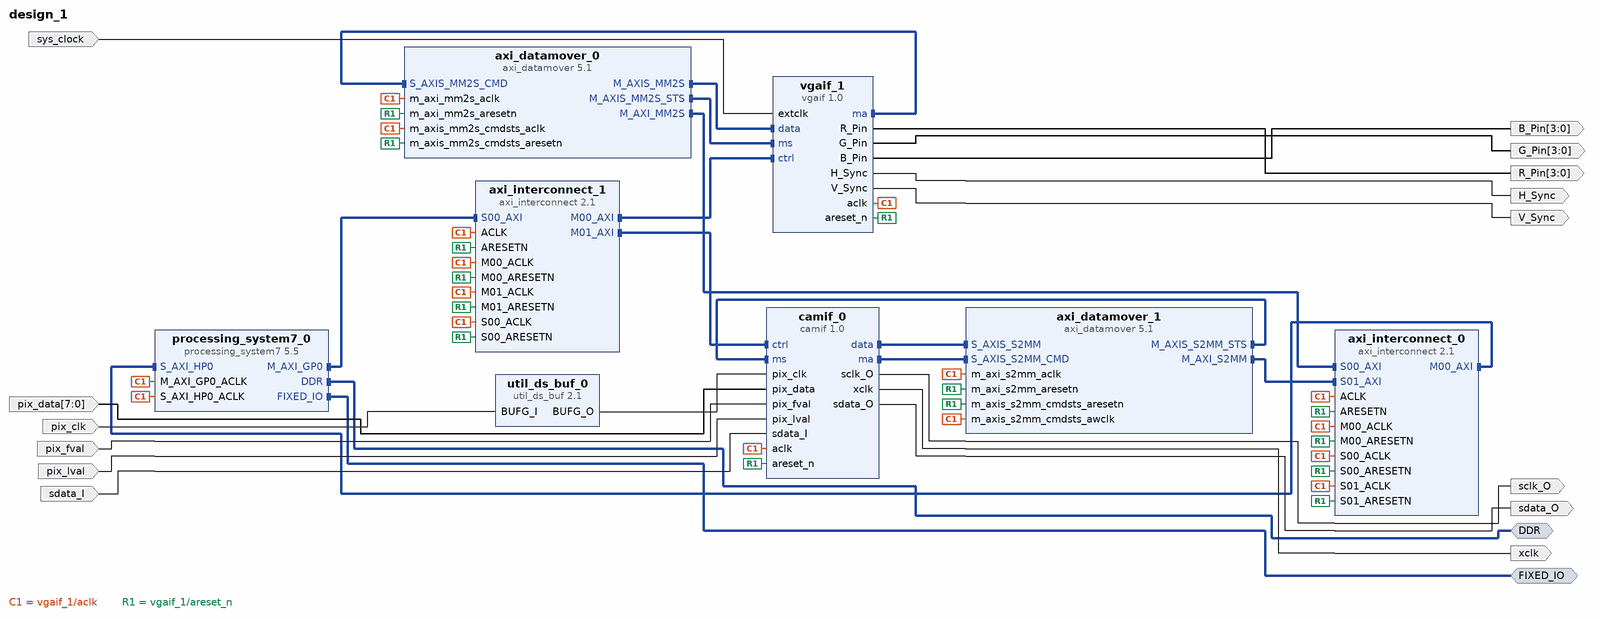
[diagram p0: block diagram of the top level]
# Vivado block design design_1, xc7z020clg484-1, Vivado 2017.2
create_bd_design design_1

create_bd_intf_port -mode Master -vlnv xilinx.com:interface:ddrx_rtl:1.0 DDR
create_bd_intf_port -mode Master -vlnv xilinx.com:display_processing_system7:fixedio_rtl:1.0 FIXED_IO
create_bd_port -dir I -type clk sys_clock
set_property -dict {CONFIG.FREQ_HZ 100000000 CONFIG.PHASE 0.000} [get_bd_ports sys_clock]
create_bd_port -dir O -from 3 -to 0 R_Pin
create_bd_port -dir O -from 3 -to 0 G_Pin
create_bd_port -dir O -from 3 -to 0 B_Pin
create_bd_port -dir O H_Sync
create_bd_port -dir O V_Sync
create_bd_port -dir O xclk
create_bd_port -dir I -from 7 -to 0 pix_data
create_bd_port -dir I pix_fval
create_bd_port -dir I pix_lval
create_bd_port -dir I -type clk pix_clk
create_bd_port -dir O sclk_O
create_bd_port -dir O sdata_O
create_bd_port -dir I sdata_I

create_bd_cell -type ip -vlnv xilinx.com:ip:axi_datamover:5.1 axi_datamover_0
set_property -dict [list \
  CONFIG.c_m_axi_mm2s_data_width 64 \
  CONFIG.c_m_axis_mm2s_tdata_width 32 \
  CONFIG.c_mm2s_burst_size 8 \
  CONFIG.c_enable_s2mm 0 \
] [get_bd_cells axi_datamover_0]
create_bd_cell -type ip -vlnv xilinx.com:ip:processing_system7:5.5 processing_system7_0
set_property -dict [list \
  CONFIG.PCW_USE_S_AXI_HP0 1 \
  CONFIG.PCW_EN_CLK0_PORT 0 \
  CONFIG.PCW_QSPI_GRP_SINGLE_SS_ENABLE 1 \
  CONFIG.PCW_USB0_PERIPHERAL_ENABLE 0 \
  CONFIG.preset ZedBoard \
] [get_bd_cells processing_system7_0]
# 1 more settings of processing_system7_0 are not shown: defaults, MIO pin electricals, DDR timing, and values the tool derives
create_bd_cell -type ip -vlnv xilinx.com:ip:axi_interconnect:2.1 axi_interconnect_0
set_property -dict {CONFIG.NUM_SI 2 CONFIG.NUM_MI 1} [get_bd_cells axi_interconnect_0]
create_bd_cell -type ip -vlnv xilinx.com:ip:axi_interconnect:2.1 axi_interconnect_1
set_property -dict {CONFIG.NUM_MI 2} [get_bd_cells axi_interconnect_1]
create_bd_cell -type ip -vlnv xilinx.com:ip:axi_datamover:5.1 axi_datamover_1
set_property -dict [list \
  CONFIG.c_include_s2mm Full \
  CONFIG.c_include_s2mm_stsfifo true \
  CONFIG.c_s2mm_addr_pipe_depth 3 \
  CONFIG.c_s2mm_include_sf true \
  CONFIG.c_m_axi_s2mm_awid 1 \
  CONFIG.c_enable_mm2s 0 \
  CONFIG.c_enable_s2mm 1 \
  CONFIG.c_enable_s2mm_adv_sig 0 \
] [get_bd_cells axi_datamover_1]
create_bd_cell -type ip -vlnv xilinx.com:ip:util_ds_buf:2.1 util_ds_buf_0
set_property -dict {CONFIG.C_BUF_TYPE BUFG} [get_bd_cells util_ds_buf_0]
create_bd_cell -type ip -vlnv user.org:user:vgaif:1.0 vgaif_1
set_property -dict {CONFIG.G_VIDEOX 2048 CONFIG.G_VIDEOY 2048 CONFIG.G_SCREENX 800 CONFIG.G_SCREENY 600} [get_bd_cells vgaif_1]
create_bd_cell -type ip -vlnv user.org:user:camif:1.0 camif_0
set_property -dict {CONFIG.G_CAMERAX 800 CONFIG.G_CAMERAY 600 CONFIG.G_ID 0xACDE1234} [get_bd_cells camif_0]

# ---- connections ----

connect_bd_intf_net [get_bd_intf_pins axi_interconnect_0/M00_AXI] [get_bd_intf_pins processing_system7_0/S_AXI_HP0]
connect_bd_intf_net [get_bd_intf_pins axi_datamover_0/M_AXI_MM2S] [get_bd_intf_pins axi_interconnect_0/S00_AXI]
connect_bd_intf_net [get_bd_intf_pins processing_system7_0/M_AXI_GP0] [get_bd_intf_pins axi_interconnect_1/S00_AXI]
connect_bd_intf_net [get_bd_intf_pins axi_datamover_0/M_AXIS_MM2S] [get_bd_intf_pins vgaif_1/data]
connect_bd_intf_net [get_bd_intf_pins axi_datamover_0/M_AXIS_MM2S_STS] [get_bd_intf_pins vgaif_1/ms]
connect_bd_intf_net [get_bd_intf_pins axi_interconnect_1/M00_AXI] [get_bd_intf_pins vgaif_1/ctrl]
connect_bd_intf_net [get_bd_intf_pins vgaif_1/ma] [get_bd_intf_pins axi_datamover_0/S_AXIS_MM2S_CMD]
connect_bd_intf_net [get_bd_intf_pins axi_interconnect_1/M01_AXI] [get_bd_intf_pins camif_0/ctrl]
connect_bd_intf_net [get_bd_intf_pins camif_0/data] [get_bd_intf_pins axi_datamover_1/S_AXIS_S2MM]
connect_bd_intf_net [get_bd_intf_pins camif_0/ma] [get_bd_intf_pins axi_datamover_1/S_AXIS_S2MM_CMD]
connect_bd_intf_net [get_bd_intf_pins axi_datamover_1/M_AXIS_S2MM_STS] [get_bd_intf_pins camif_0/ms]
connect_bd_intf_net [get_bd_intf_pins axi_datamover_1/M_AXI_S2MM] [get_bd_intf_pins axi_interconnect_0/S01_AXI]
connect_bd_intf_net [get_bd_intf_ports DDR] [get_bd_intf_pins processing_system7_0/DDR]
connect_bd_intf_net [get_bd_intf_ports FIXED_IO] [get_bd_intf_pins processing_system7_0/FIXED_IO]
connect_bd_net -net vgaif_0_aclk [get_bd_pins vgaif_1/aclk] \
  [get_bd_pins axi_datamover_0/m_axi_mm2s_aclk] [get_bd_pins axi_datamover_0/m_axis_mm2s_cmdsts_aclk] \
  [get_bd_pins processing_system7_0/M_AXI_GP0_ACLK] [get_bd_pins processing_system7_0/S_AXI_HP0_ACLK] \
  [get_bd_pins axi_datamover_1/m_axi_s2mm_aclk] [get_bd_pins axi_datamover_1/m_axis_s2mm_cmdsts_awclk] \
  [get_bd_pins axi_interconnect_0/ACLK] [get_bd_pins axi_interconnect_0/S00_ACLK] [get_bd_pins axi_interconnect_0/M00_ACLK] \
  [get_bd_pins axi_interconnect_1/ACLK] [get_bd_pins axi_interconnect_1/S00_ACLK] [get_bd_pins axi_interconnect_1/M00_ACLK] \
  [get_bd_pins axi_interconnect_1/M01_ACLK] [get_bd_pins axi_interconnect_0/S01_ACLK] [get_bd_pins camif_0/aclk]
connect_bd_net -net vgaif_0_areset_n [get_bd_pins vgaif_1/areset_n] \
  [get_bd_pins axi_datamover_0/m_axi_mm2s_aresetn] [get_bd_pins axi_datamover_0/m_axis_mm2s_cmdsts_aresetn] \
  [get_bd_pins axi_datamover_1/m_axi_s2mm_aresetn] [get_bd_pins axi_datamover_1/m_axis_s2mm_cmdsts_aresetn] \
  [get_bd_pins axi_interconnect_0/M00_ARESETN] [get_bd_pins axi_interconnect_0/S00_ARESETN] \
  [get_bd_pins axi_interconnect_0/ARESETN] [get_bd_pins axi_interconnect_1/M00_ARESETN] \
  [get_bd_pins axi_interconnect_1/S00_ARESETN] [get_bd_pins axi_interconnect_1/ARESETN] \
  [get_bd_pins axi_interconnect_1/M01_ARESETN] [get_bd_pins axi_interconnect_0/S01_ARESETN] [get_bd_pins camif_0/areset_n]
connect_bd_net [get_bd_ports sys_clock] [get_bd_pins vgaif_1/extclk]
connect_bd_net [get_bd_pins vgaif_1/R_Pin] [get_bd_ports R_Pin]
connect_bd_net [get_bd_pins vgaif_1/G_Pin] [get_bd_ports G_Pin]
connect_bd_net [get_bd_pins vgaif_1/B_Pin] [get_bd_ports B_Pin]
connect_bd_net [get_bd_pins vgaif_1/H_Sync] [get_bd_ports H_Sync]
connect_bd_net [get_bd_pins vgaif_1/V_Sync] [get_bd_ports V_Sync]
connect_bd_net [get_bd_pins camif_0/xclk] [get_bd_ports xclk]
connect_bd_net [get_bd_ports pix_data] [get_bd_pins camif_0/pix_data]
connect_bd_net [get_bd_ports pix_fval] [get_bd_pins camif_0/pix_fval]
connect_bd_net [get_bd_ports pix_lval] [get_bd_pins camif_0/pix_lval]
connect_bd_net [get_bd_ports pix_clk] [get_bd_pins util_ds_buf_0/BUFG_I]
connect_bd_net [get_bd_pins util_ds_buf_0/BUFG_O] [get_bd_pins camif_0/pix_clk]
connect_bd_net [get_bd_pins camif_0/sclk_O] [get_bd_ports sclk_O]
connect_bd_net [get_bd_pins camif_0/sdata_O] [get_bd_ports sdata_O]
connect_bd_net [get_bd_ports sdata_I] [get_bd_pins camif_0/sdata_I]

# ---- address map ----
assign_bd_address -offset 0x00000000 -range 512M -target_address_space [get_bd_addr_spaces axi_datamover_0/Data_MM2S] [get_bd_addr_segs processing_system7_0/S_AXI_HP0/HP0_DDR_LOWOCM]
assign_bd_address -offset 0x00000000 -range 512M -target_address_space [get_bd_addr_spaces axi_datamover_1/Data_S2MM] [get_bd_addr_segs processing_system7_0/S_AXI_HP0/HP0_DDR_LOWOCM]
assign_bd_address -offset 0x40000000 -range 64K -target_address_space [get_bd_addr_spaces processing_system7_0/Data] [get_bd_addr_segs vgaif_1/ctrl/reg0]
assign_bd_address -offset 0x40010000 -range 64K -target_address_space [get_bd_addr_spaces processing_system7_0/Data] [get_bd_addr_segs camif_0/ctrl/reg0]

validate_bd_design
save_bd_design
